# EAGLE design attiny-devboard (EAGLE 7.3.0)
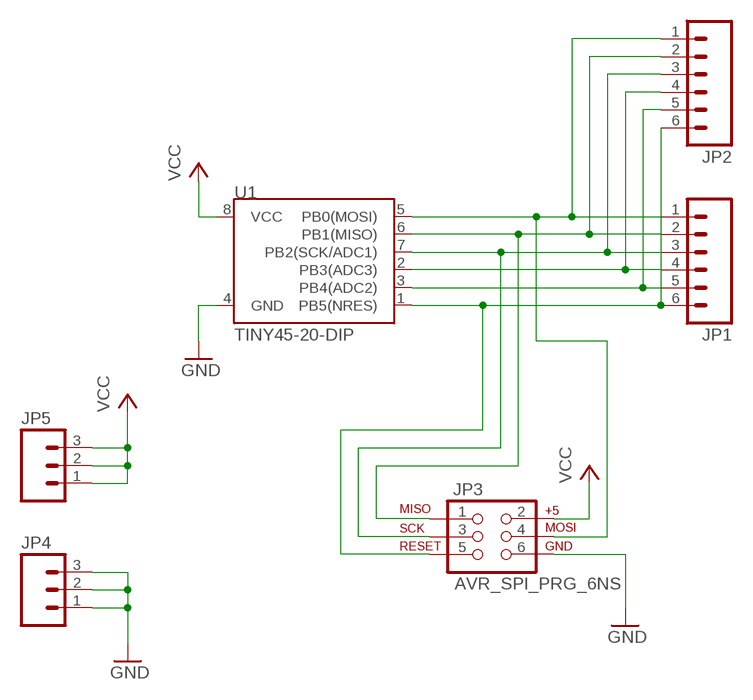
[diagram p0: schematic, sheet 1]

## Parts
JP1  M06LOCK  [1X06_LOCK]
JP2  M06LOCK  [1X06_LOCK]
JP3  AVR_SPI_PRG_6NS  [2X3-NS]
JP4  M03LOCK  [1X03_LOCK]
JP5  M03LOCK  [1X03_LOCK]
U1  TINY45-20-DIP  ATTINY45TINY45-20-DIP  [DIP08]

## Nets
GND: JP3.6 JP4.1 JP4.2 JP4.3 U1.4(GND)
N$1: JP1.1 JP2.1 JP3.4 U1.5(PB0(MOSI))
N$2: JP1.2 JP2.2 JP3.1 U1.6(PB1(MISO))
N$3: JP1.3 JP2.3 JP3.3 U1.7(PB2(SCK/ADC1))
N$4: JP1.4 JP2.4 U1.2(PB3(ADC3))
N$5: JP1.5 JP2.5 U1.3(PB4(ADC2))
N$6: JP1.6 JP2.6 JP3.5 U1.1(PB5(NRES))
VCC: JP3.2 JP5.1 JP5.2 JP5.3 U1.8(VCC)

## Library data of the parts
JP1 JP2 = SparkFun-Connectors:M06: Header 6 Standard 6-pin 0.1" header. Use with straight break away headers (SKU : PRT-00116), right angle break away headers (PRT-00553), swiss pins (PRT-00743), machine pins (PRT-00117), and female headers (PRT-00115). Molex polarized connector foot print use with SKU : PRT-08094 with associated crimp pins and housings. NOTES ON THE VARIANTS LOCK and LOCK_LONGPADS... This footprint was designed to help hold the alignment of a through-hole component (i.e. 6-pin header) while soldering it into place. You may notice that each hole has been shifted either up or down by 0.005 of an inch from it's more standard position (which is a perfectly straight line). This slight alteration caused the pins (the squares in the middle) to touch the edges of the holes. Because they are alternating, it causes a "brace" to hold the component in place. 0.005 has proven to be the perfect amount of "off-center" position when using our standard breakaway headers. Although looks a little odd when you look at the bare footprint, once you have a header in there, the alteration is very hard to notice. Also,if you push a header all the way into place, it is covered up entirely on the bottom side. This idea of altering the position of holes to aid alignment will be further integrated into the Sparkfun Library for other footprints. It can help hold any component with 3 or more connection pins.
JP3 = SparkFun-Connectors:AVR_SPI_PRG_6: AVR ISP 6 Pin This is the reduced ISP connector for AVR programming. Common on Arduino. This footprint will take up less PCB space and can be used with a 10-pin to 6-pin adapter such as SKU: BOB-08508 **Special note about "TEST_POINT" package. The stop mask is on the top side, so if you want your programming test points to be on the bottom of your board, make sure to place this package on the bottom side of the board. This also ensure that the orientation to program from the bottom side will be correct.
JP4 JP5 = SparkFun-Connectors:M03: Header 3 Standard 3-pin 0.1" header. Use with straight break away headers (SKU : PRT-00116), right angle break away headers (PRT-00553), swiss pins (PRT-00743), machine pins (PRT-00117), and female headers (PRT-00115). Molex polarized connector foot print use with SKU : PRT-08232 with associated crimp pins and housings.
U1 = SparkFun-DigitalIC:ATTINY45: Atmel 8-pin 2/4/8kB flash uC; PROD_ID: IC-09439

## Board
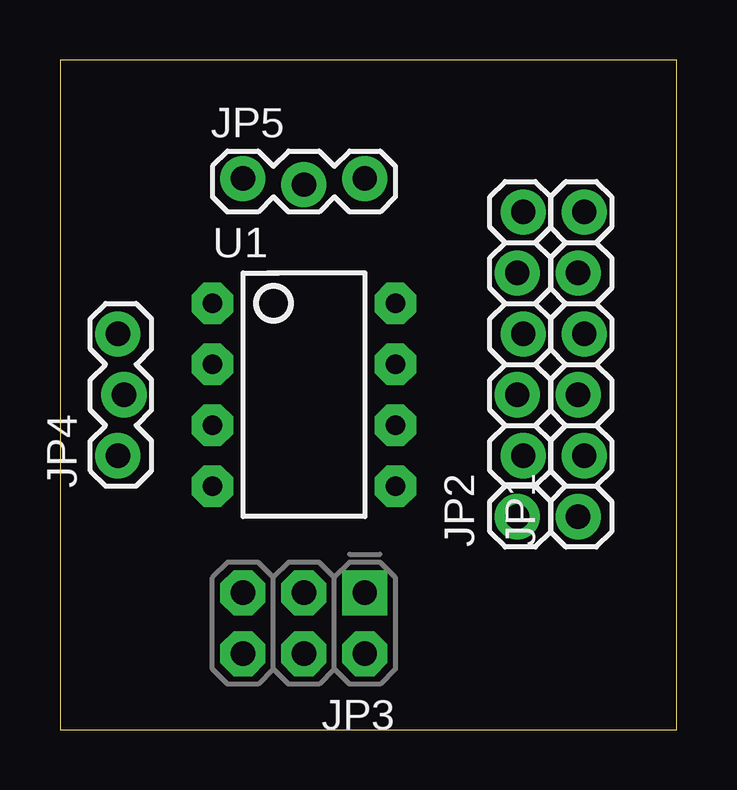
[diagram p1: board, top side]
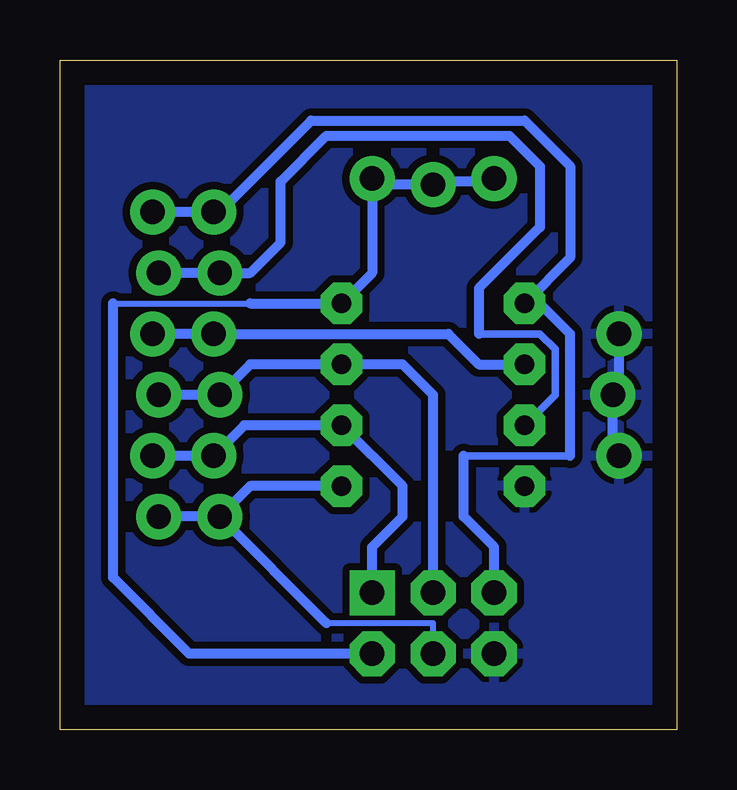
[diagram p2: board, bottom side, seen from below]

Size 25.7 x 27.93 mm. Coordinates in mm from the lower left corner, seen from the top.
Outline: 0,0 25.7,0 25.7,27.93 0,27.93 0,0
Copper layers (1*16): Top 0.035mm / dielectric 1.5mm / Bottom 0.035mm
Design rules "default *": minimum track width 10mil, minimum drill 24mil, track to track 8mil, track to pad 8mil, pad to pad 8mil, via to via 8mil, smd to smd 8mil, copper to edge 40mil, drill to drill 8mil, minimum pad ring 0.4mm, minimum via ring 8mil, stop-mask expansion 4mil, vias tented up to drill 0mil, thermal gap 10mil

### Footprints (pad centres in the part's own frame; a part is rotated, then mirrored left to right if it is on the bottom)
1X06_LOCK = drill 1.016 pad 1.88: 1 0,0; 2 2.54,-0.254; 3 5.08,0; 4 7.62,-0.254; 5 10.16,0; 6 12.7,-0.254
2X3-NS = drill 1.016 pad 1.88 square: 1 -2.54,-1.27 | drill 1.016 pad 1.88 octagon: 2 -2.54,1.27; 3 0,-1.27; 4 0,1.27; 5 2.54,-1.27; 6 2.54,1.27
1X03_LOCK = drill 1.016 pad 1.88: 1 0,0.127; 2 2.54,-0.127; 3 5.08,0.127
DIP08 = drill 0.813 pad 1.727 octagon: 1 -3.81,-3.81; 2 -1.27,-3.81; 3 1.27,-3.81; 4 3.81,-3.81; 5 3.81,3.81; 6 1.27,3.81; 7 -1.27,3.81; 8 -3.81,3.81

### Placement (x,y rotation side)
JP1  21.59,8.89 90 top
JP2  19.05,8.89 90 top
JP3  10.16,4.45 180 top
JP4  2.54,11.43 90 top
JP5  7.62,22.86 0 top
U1  10.16,13.97 270 top

### Tracks (layer width: path | path; a pad name or v marks a point on that pad's centre or on a via)
GND
  Bottom 0.406: JP4.1 2.67,11.43 JP4.2 2.41,13.97 JP4.3
  pour Bottom (isolate 0.305): 0,26.67 24.77,26.67 24.77,0 0,0
N$1
  Bottom 0.254: JP3.4 10.16,4.45 14.61,4.45
  Bottom 0.406: JP2.1 JP1.1 | U1.5 17.78,10.16 JP2.1 | 14.61,4.45 JP2.1
N$2
  Bottom 0.406: JP1.2 JP2.2 18.03,12.7 U1.6 11.43,10.16 11.43,8.89 12.7,7.62 JP3.1
N$3
  Bottom 0.406: JP1.3 JP2.3 17.78,15.24 U1.7 11.43,15.24 10.16,13.97 JP3.3
N$4
  Bottom 0.406: JP1.4 JP2.4 9.53,16.51 8.26,15.24 U1.2
N$5
  Bottom 0.305: 8.26,16.51 5.71,16.51 5.08,15.88 5.08,13.97 U1.3
  Bottom 0.406: JP1.5 JP2.5 17.78,19.05 16.51,20.32 16.51,22.86 14.61,24.77 6.99,24.77 5.71,23.5 5.71,20.95 8.26,18.41 8.26,16.51
N$6
  Bottom 0.305: 8.89,11.43 4.45,11.43
  Bottom 0.406: JP1.6 JP2.6 19.05,21.59 15.24,25.4 6.35,25.4 4.45,23.5 4.45,19.68 U1.1 5.71,17.78 4.45,16.51 4.45,11.43 | JP3.5 7.62,7.62 8.89,8.89 8.89,11.43
VCC
  Bottom 0.254: 23.5,17.78 17.78,17.78
  Bottom 0.406: JP5.1 7.62,22.86 10.16,22.86 JP5.2 12.7,22.73 | 12.7,22.73 JP5.3 | 12.7,22.73 12.7,19.05 U1.8 17.78,17.78 | JP3.2 20.32,3.17 23.5,6.35 23.5,17.78

### Text on the board
tSilk: 0 | VCC | 1 | 2 | GND | 3 | 4 | 5